# EAGLE schematic headstage-64_via-reduce (EAGLE 8.3.2)
DESIGNER: JON NEWMAN, JAKOB VOIGTS; DESIGN_NAME: HEADSTAGE-64; LICENSE: CERN OHL v1.2; REVISION: 1.2
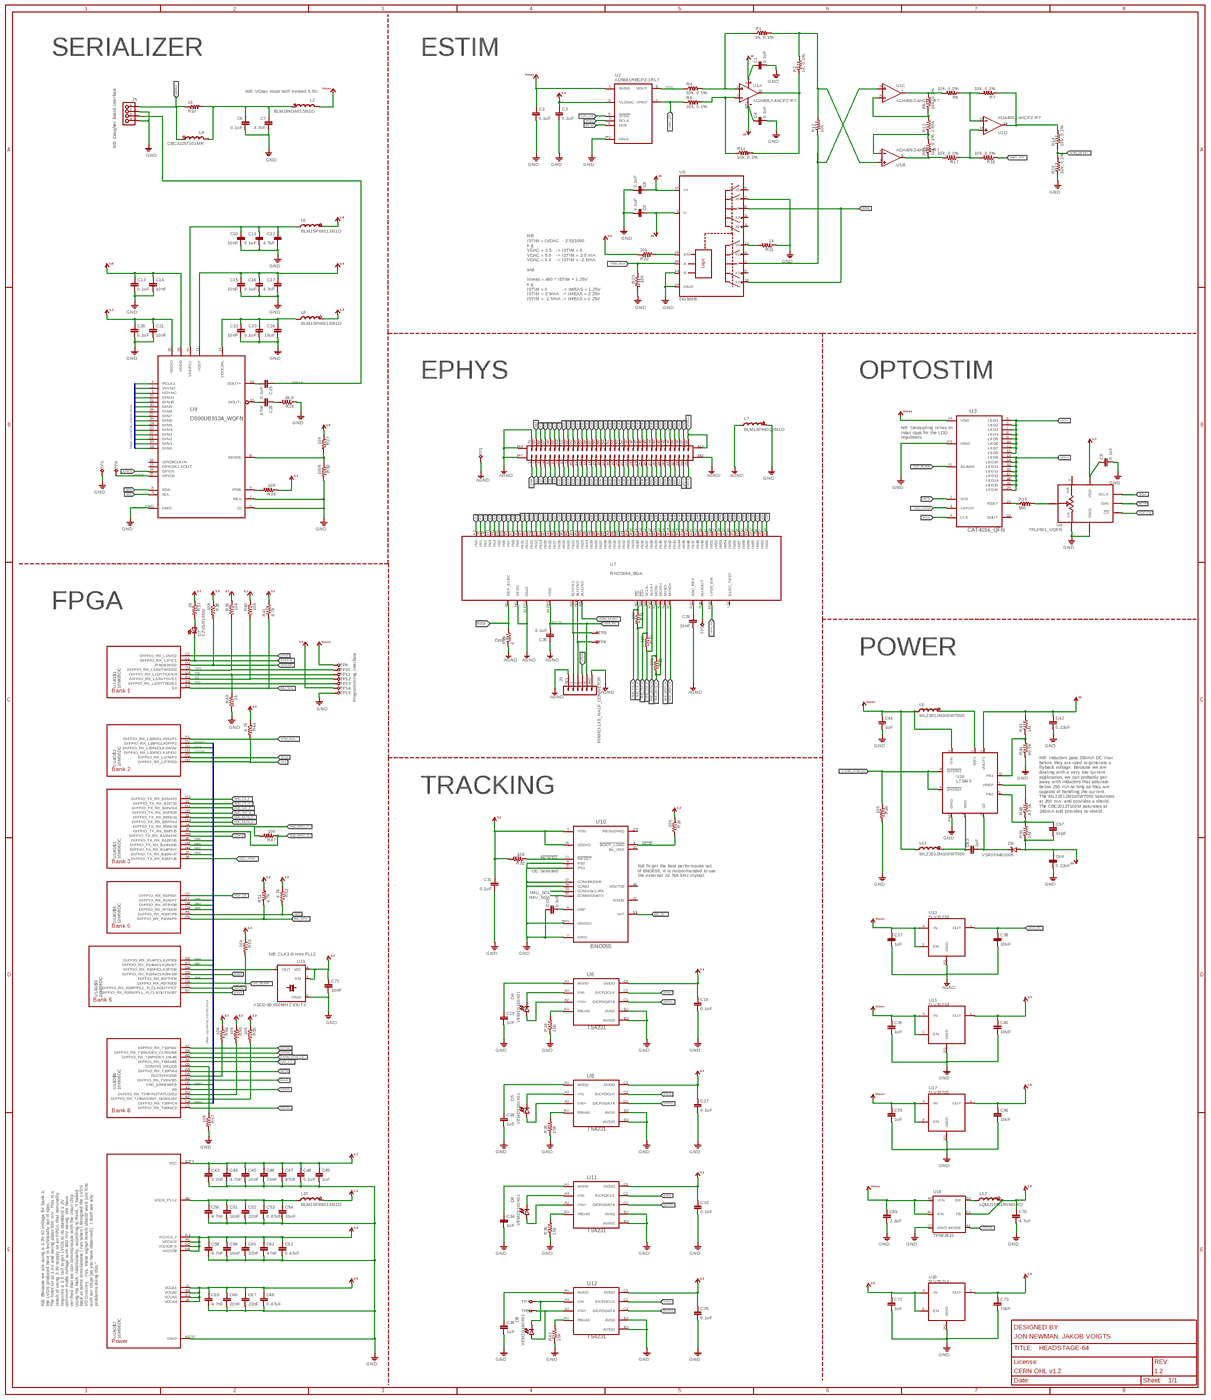
[diagram p0: schematic, sheet 1, overview]
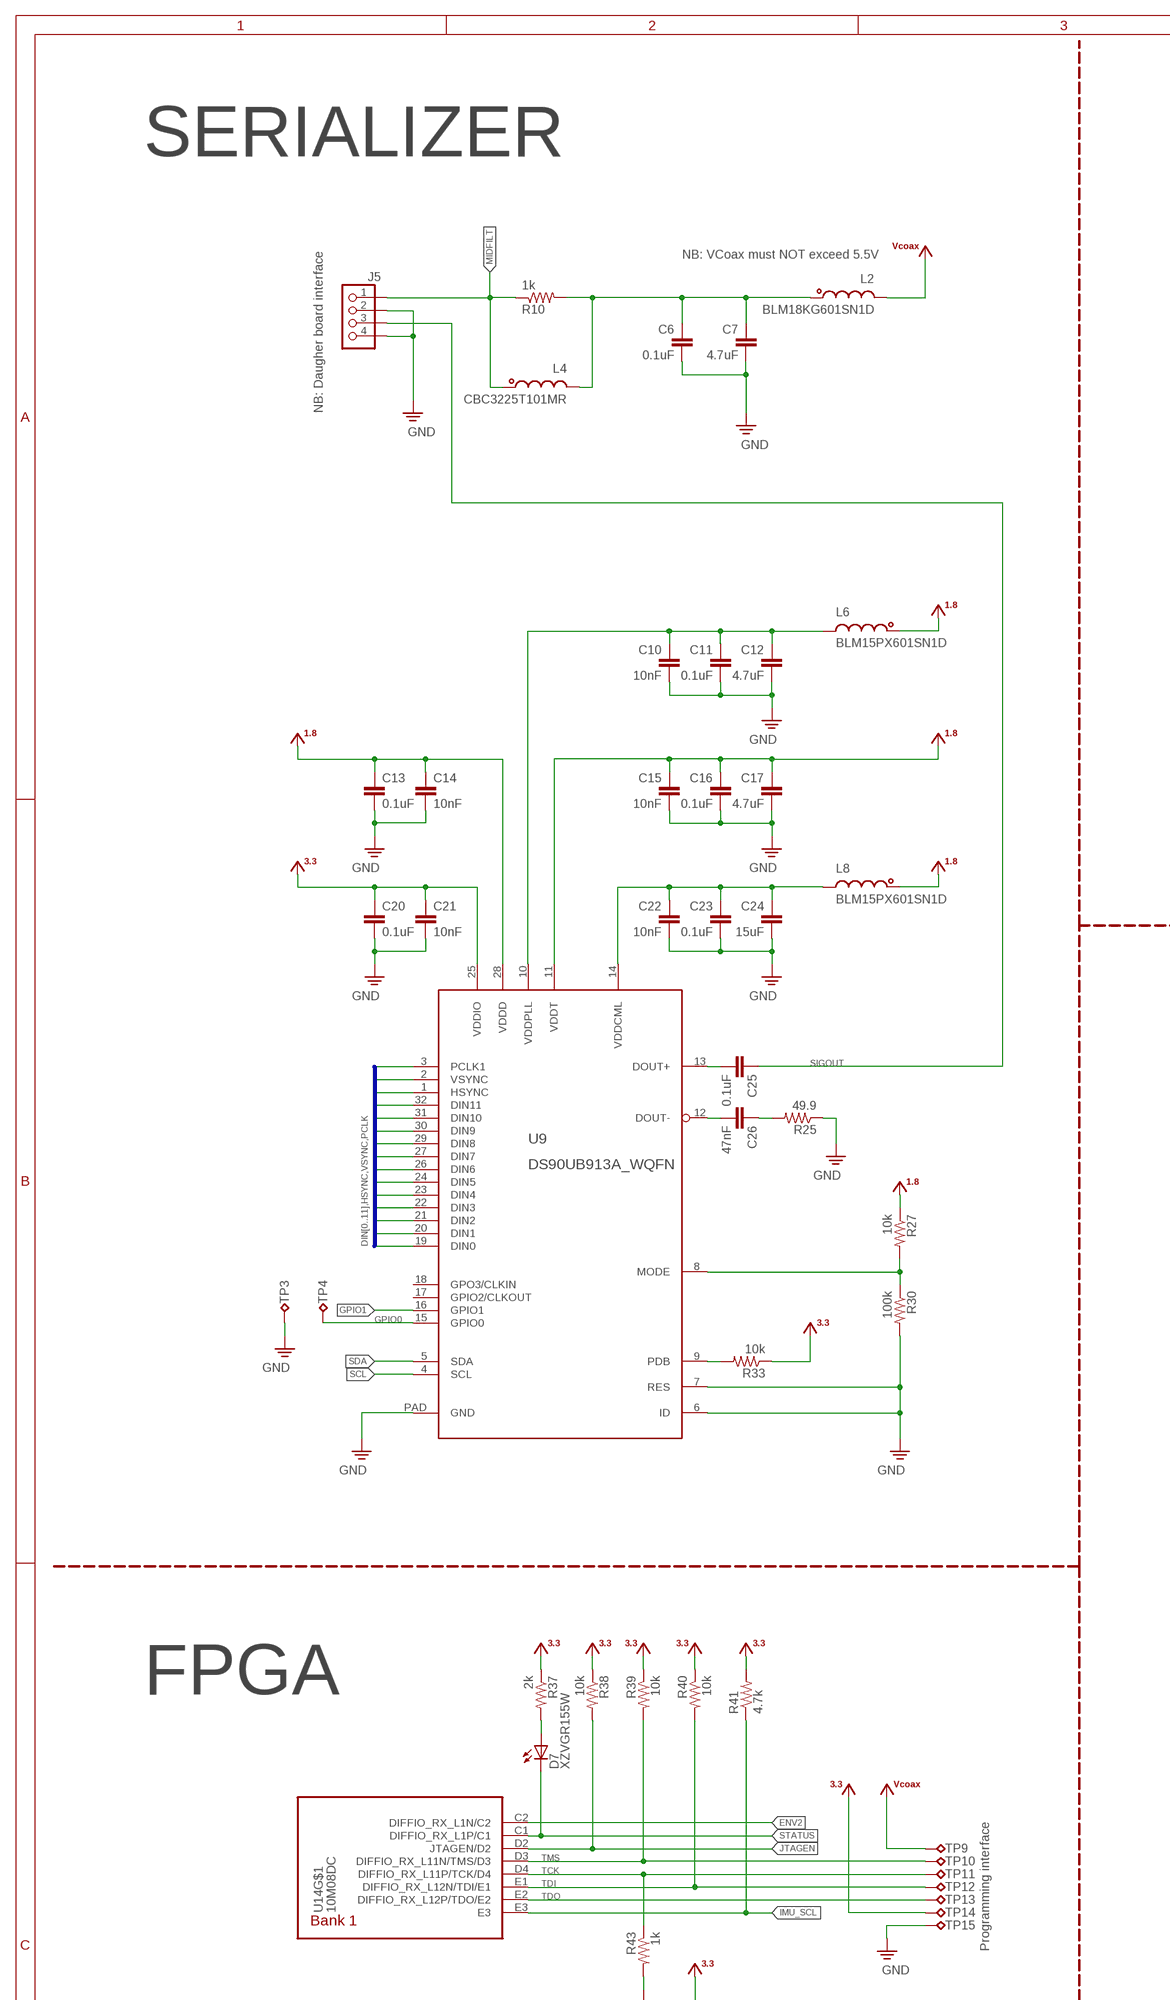
[diagram p1: schematic, sheet 1, part 1 of 4]
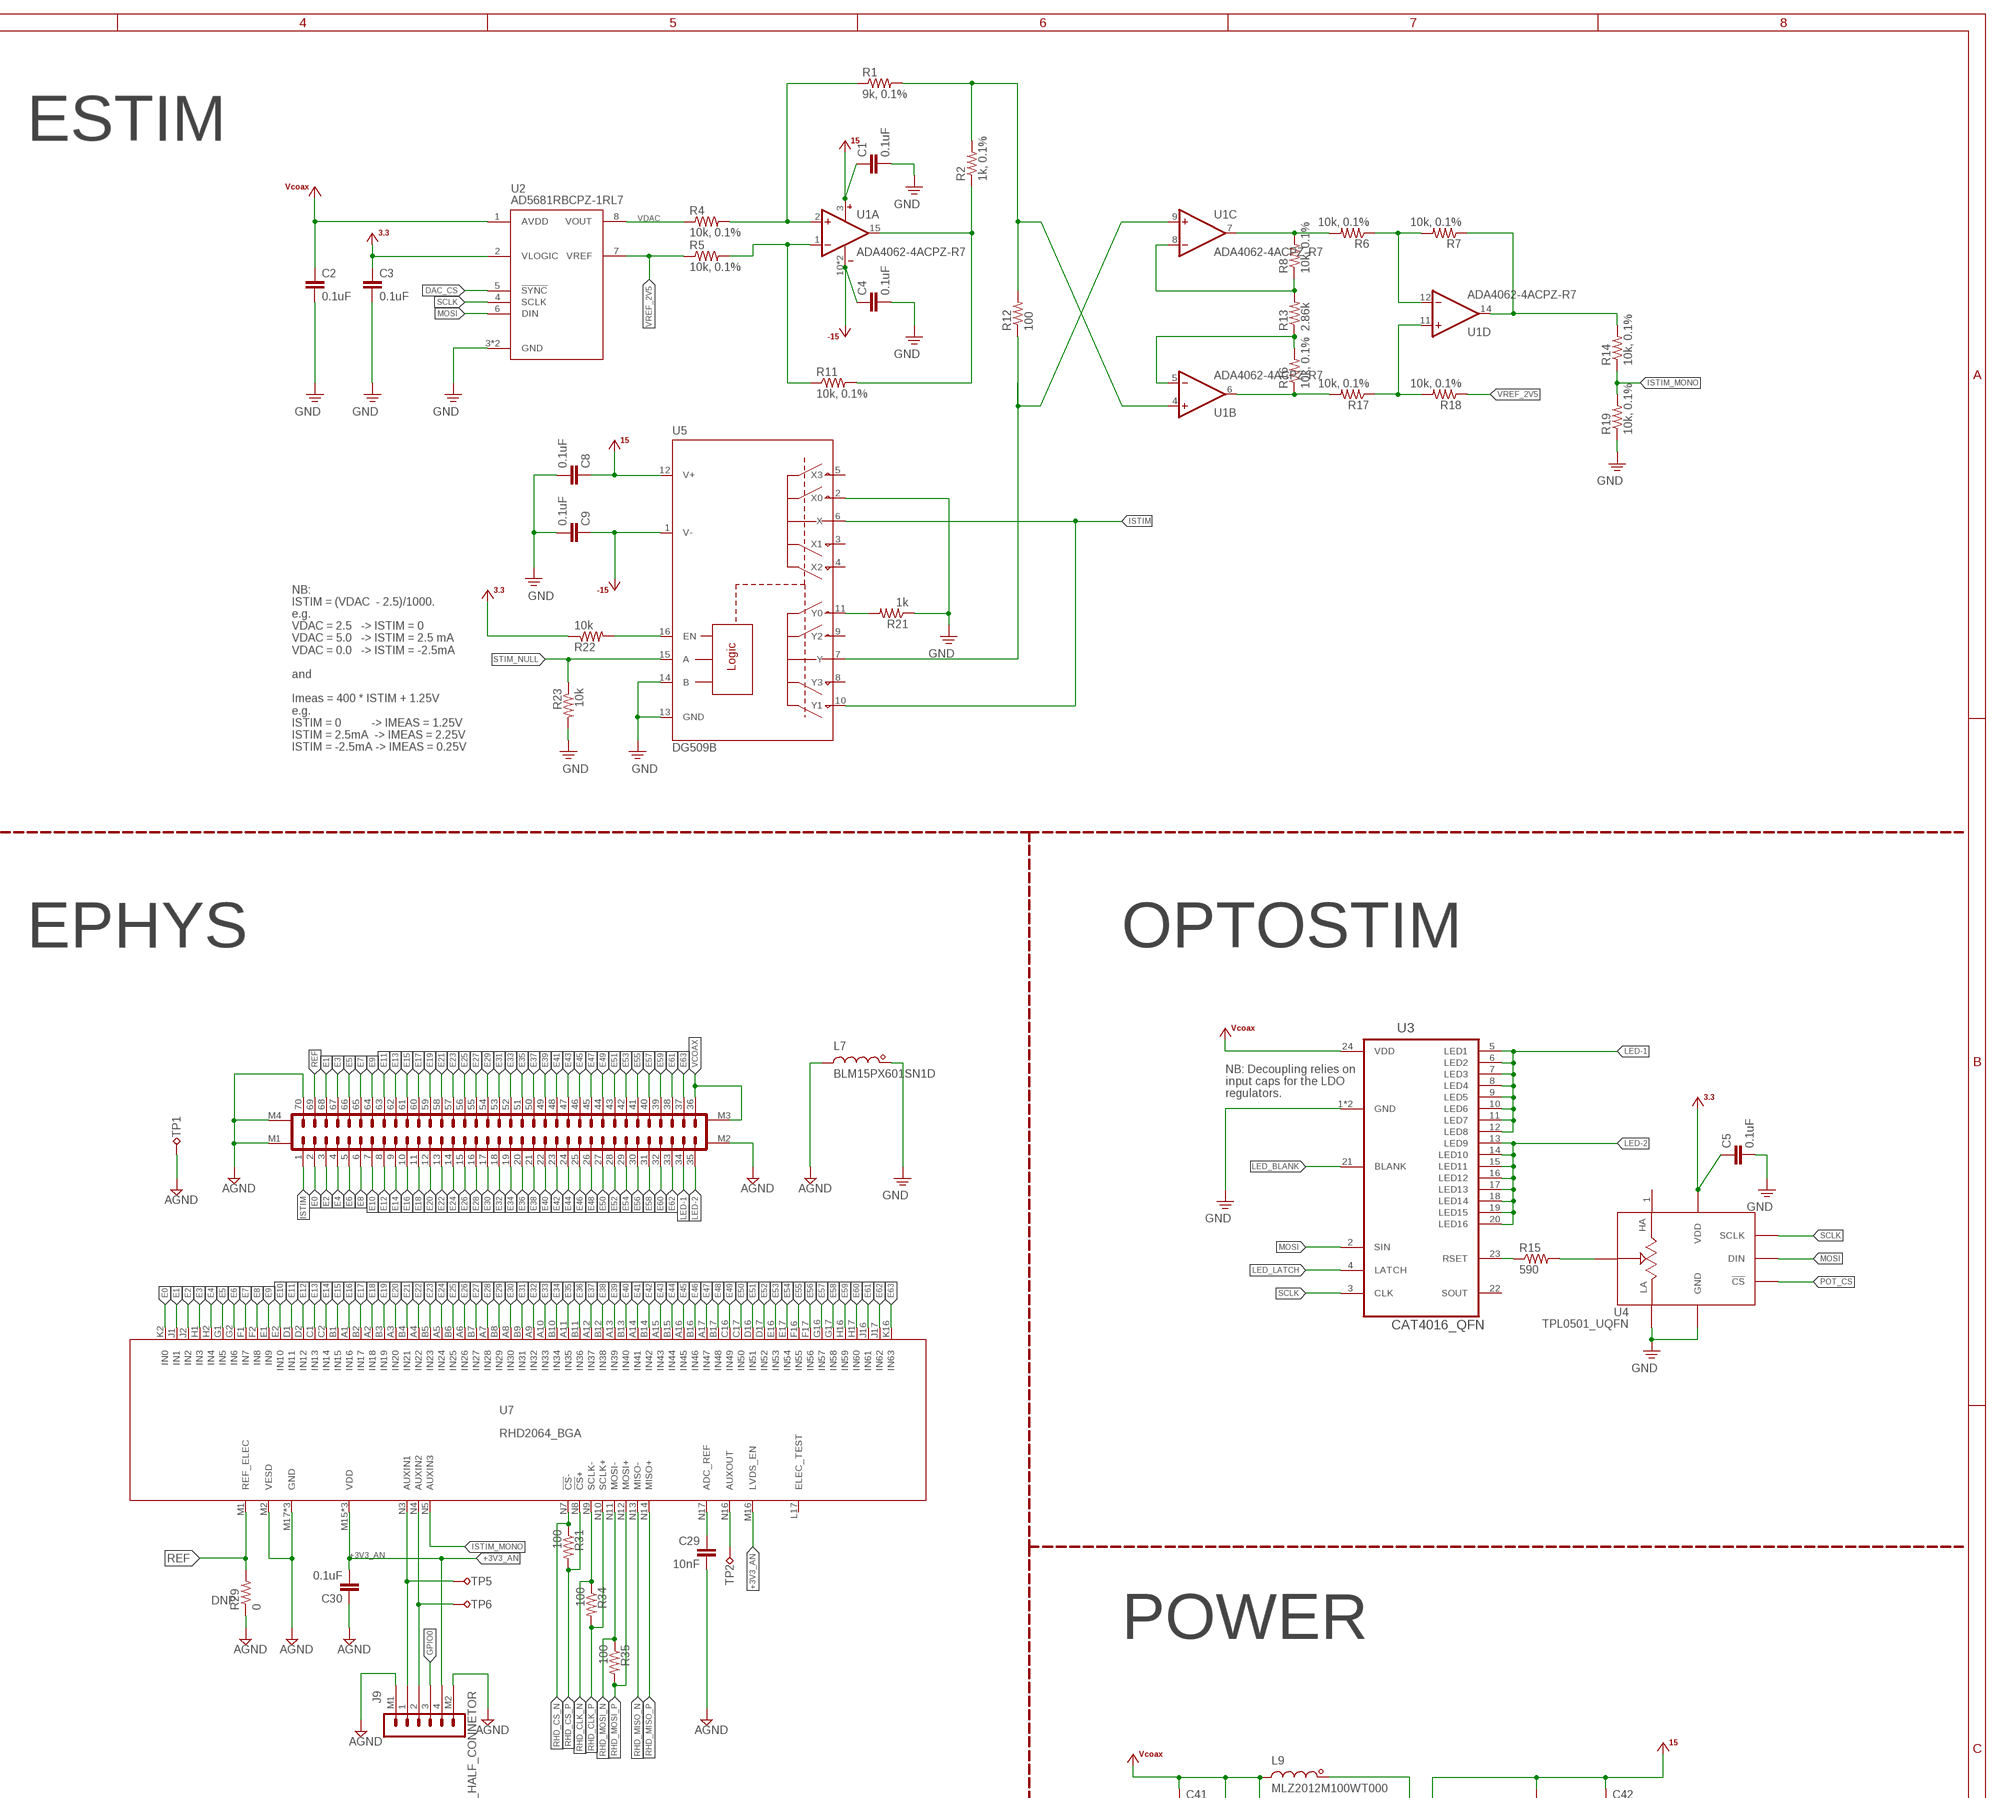
[diagram p2: schematic, sheet 1, part 2 of 4]
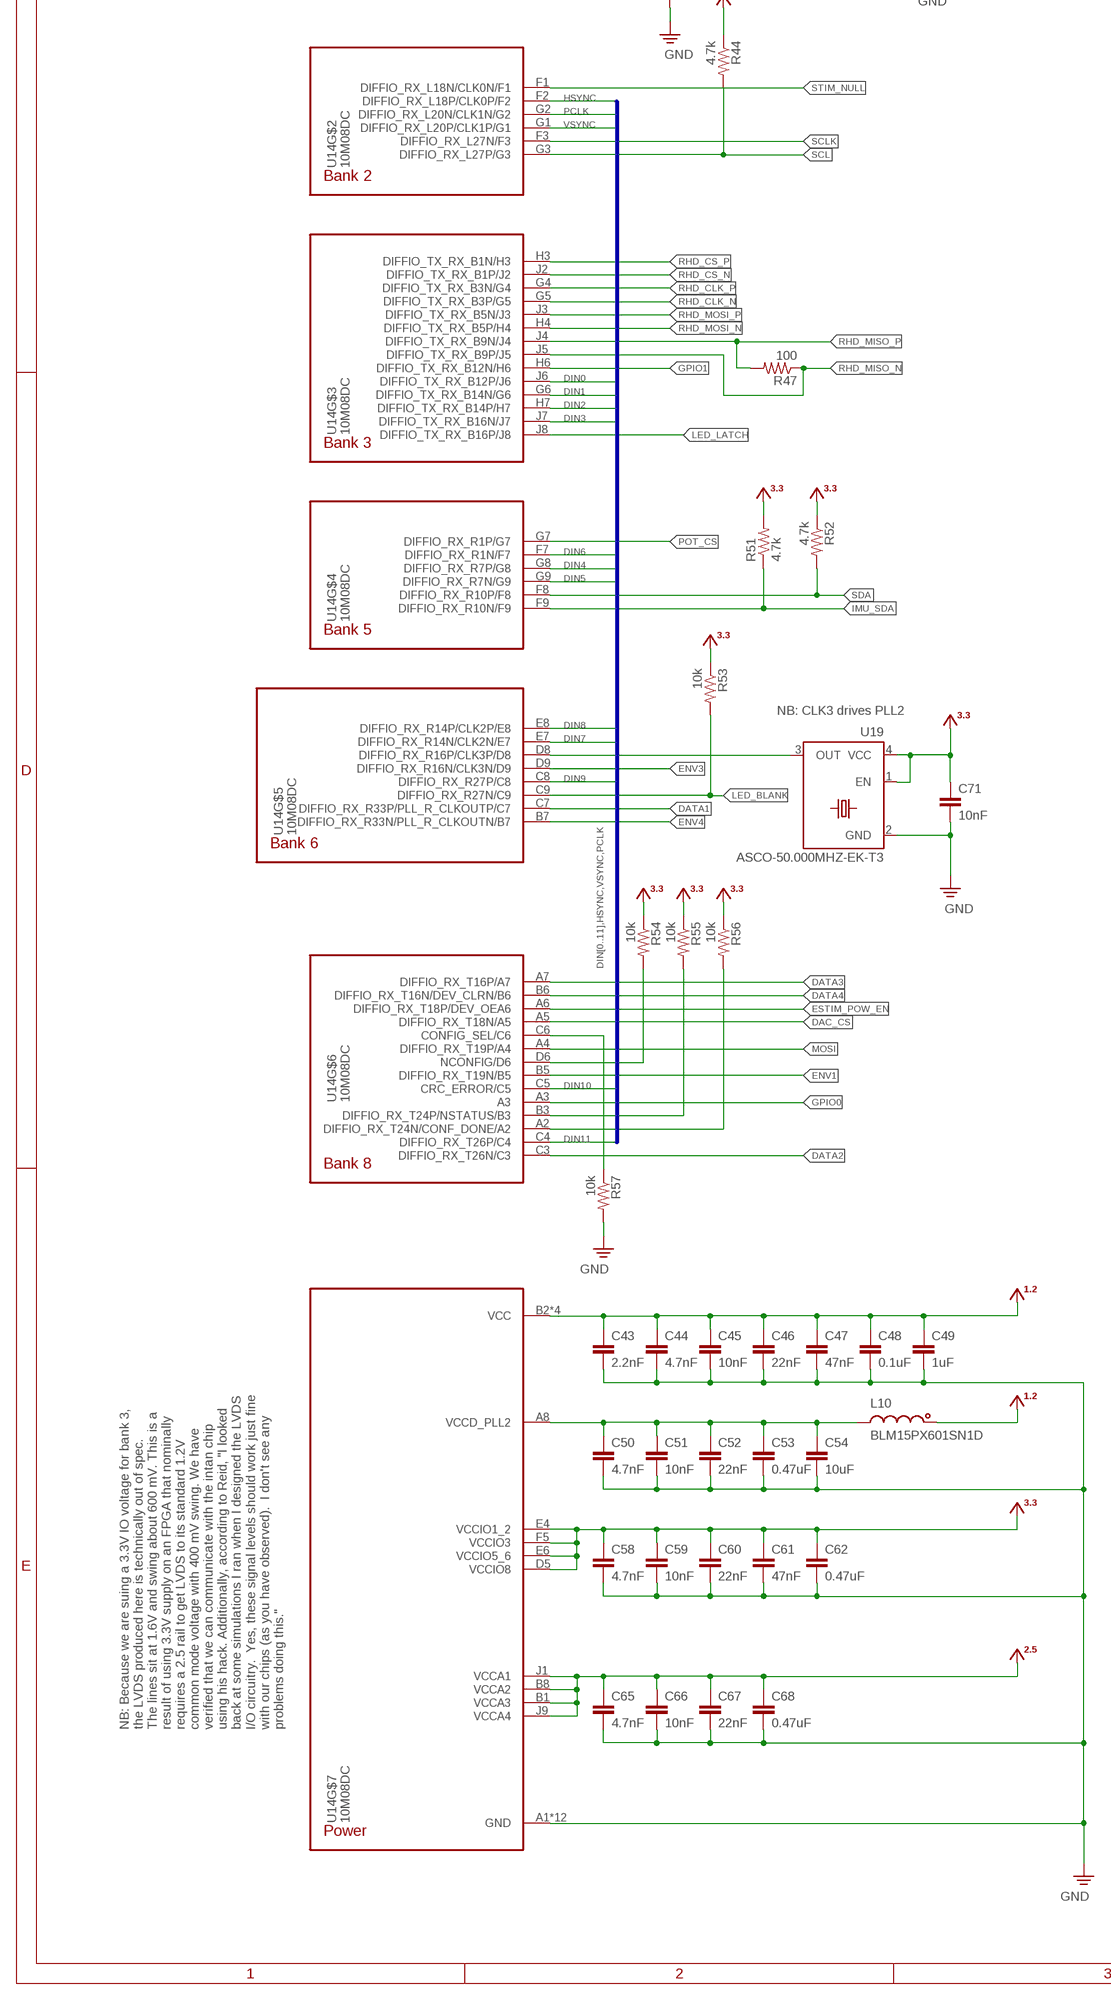
[diagram p3: schematic, sheet 1, part 3 of 4]
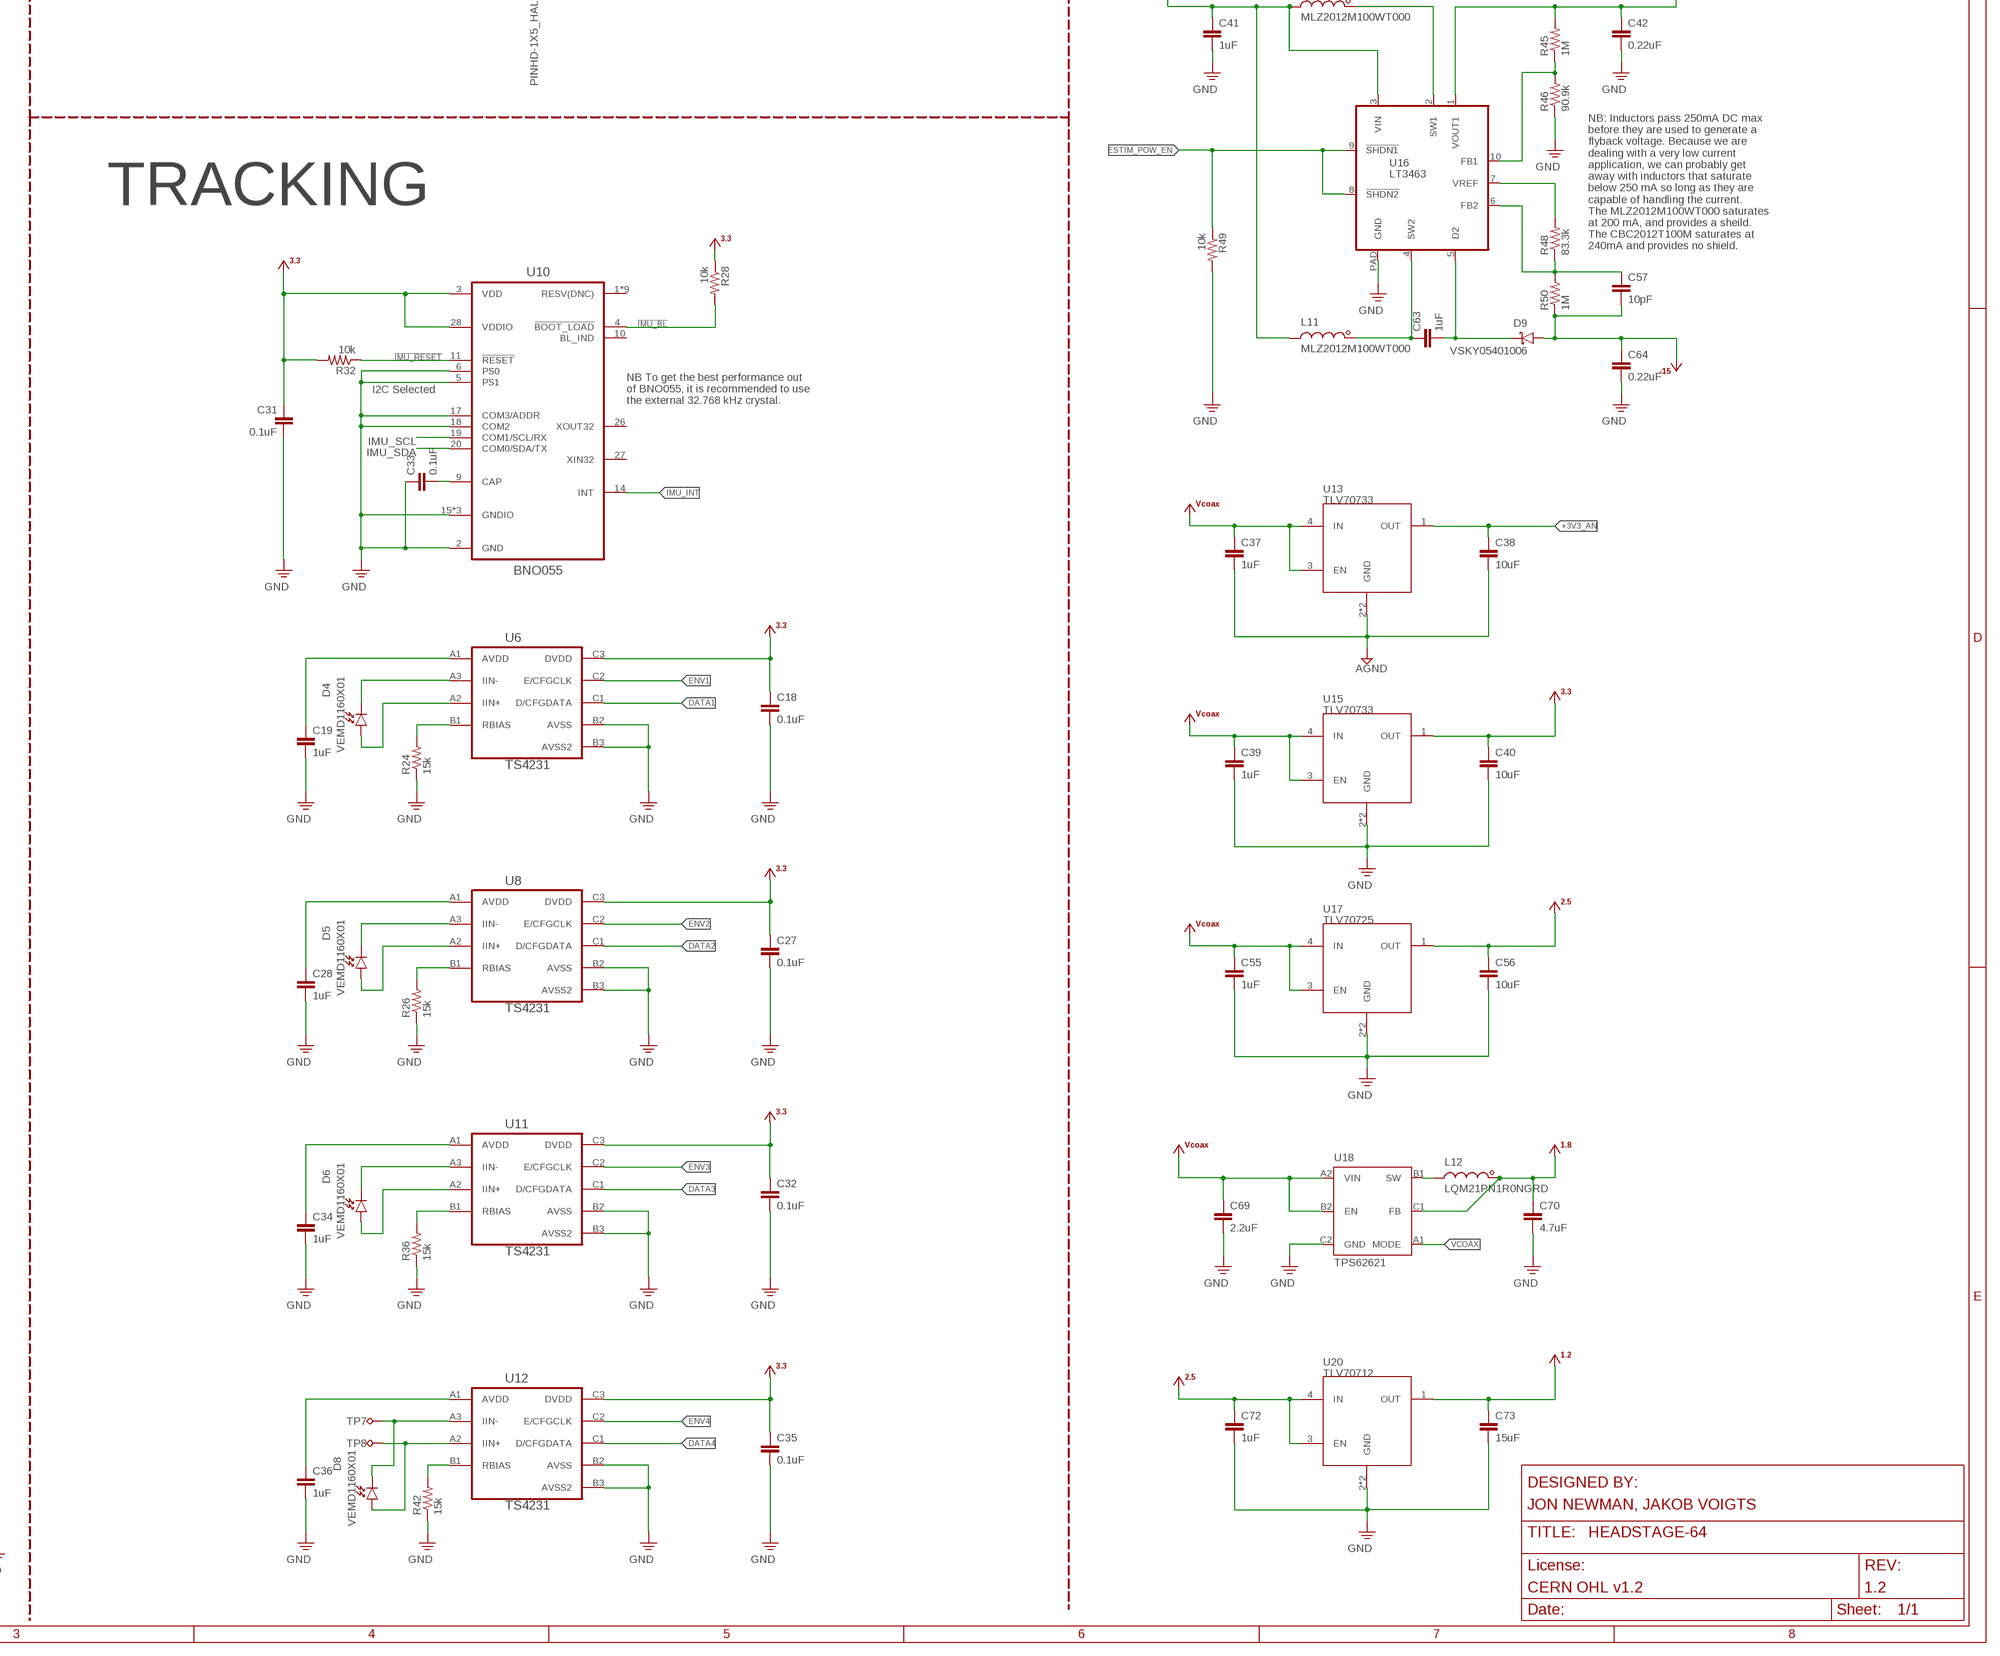
[diagram p4: schematic, sheet 1, part 4 of 4]

## Parts
C1  0.1uF  C_0201T  [0201T]
C2  0.1uF  C_0201T  [0201T]
C3  0.1uF  C_0201T  [0201T]
C4  0.1uF  C_0201T  [0201T]
C5  0.1uF  C_0201T  [0201T]
C6  0.1uF  C_0201T  [0201T]
C7  4.7uF  C_0402T  [0402T]
C8  0.1uF  C_0201T  [0201T]
C9  0.1uF  C_0201T  [0201T]
C10  10nF  C_0201T  [0201T]
C11  0.1uF  C_0201T  [0201T]
C12  4.7uF  C_0402T  [0402T]
C13  0.1uF  C_0201T  [0201T]
C14  10nF  C_0201T  [0201T]
C15  10nF  C_0201T  [0201T]
C16  0.1uF  C_0201T  [0201T]
C17  4.7uF  C_0402T  [0402T]
C18  0.1uF  C_0201T  [0201T]
C19  1uF  C_0201T  [0201T]
C20  0.1uF  C_0201T  [0201T]
C21  10nF  C_0201T  [0201T]
C22  10nF  C_0201T  [0201T]
C23  0.1uF  C_0201T  [0201T]
C24  15uF  C_0402T  [0402T]
C25  0.1uF  C_0201T  [0201T]
C26  47nF  C_0201T  [0201T]
C27  0.1uF  C_0201T  [0201T]
C28  1uF  C_0201T  [0201T]
C29  10nF  C_0201T  [0201T]
C30  0.1uF  C_0201T  [0201T]
C31  0.1uF  C_0201T  [0201T]
C32  0.1uF  C_0201T  [0201T]
C33  0.1uF  C_0201T  [0201T]
C34  1uF  C_0201T  [0201T]
C35  0.1uF  C_0201T  [0201T]
C36  1uF  C_0201T  [0201T]
C37  1uF  C_0402T  [0402T]
C38  10uF  C_0402T  [0402T]
C39  1uF  C_0402T  [0402T]
C40  10uF  C_0402T  [0402T]
C41  1uF  C_0402T  [0402T]
C42  0.22uF  C_0402T  [0402T]
C43  2.2nF  C_0201T  [0201T]
C44  4.7nF  C_0201T  [0201T]
C45  10nF  C_0201T  [0201T]
C46  22nF  C_0201T  [0201T]
C47  47nF  C_0201T  [0201T]
C48  0.1uF  C_0201T  [0201T]
C49  1uF  C_0201T  [0201T]
C50  4.7nF  C_0201T  [0201T]
C51  10nF  C_0201T  [0201T]
C52  22nF  C_0201T  [0201T]
C53  0.47uF  C_0201T  [0201T]
C54  10uF  C_0402T  [0402T]
C55  1uF  C_0402T  [0402T]
C56  10uF  C_0402T  [0402T]
C57  10pF  C_0201T  [0201T]
C58  4.7nF  C_0201T  [0201T]
C59  10nF  C_0201T  [0201T]
C60  22nF  C_0201T  [0201T]
C61  47nF  C_0201T  [0201T]
C62  0.47uF  C_0201T  [0201T]
C63  1uF  C_0402T  [0402T]
C64  0.22uF  C_0402T  [0402T]
C65  4.7nF  C_0201T  [0201T]
C66  10nF  C_0201T  [0201T]
C67  22nF  C_0201T  [0201T]
C68  0.47uF  C_0201T  [0201T]
C69  2.2uF  C_0402T  [0402T]
C70  4.7uF  C_0402T  [0402T]
C71  10nF  C_0201T  [0201T]
C72  1uF  C_0402T  [0402T]
C73  15uF  C_0402T  [0402T]
D4  VEMD1160X01  PHOTODIODE_0805PT  [0805PT]
D5  VEMD1160X01  PHOTODIODE_0805PT  [0805PT]
D6  VEMD1160X01  PHOTODIODE_0805PT  [0805PT]
D7  XZVGR155W  LED_0201T  [LED-0201T]
D8  VEMD1160X01  PHOTODIODE_0805PT  [0805PT]
D9  VSKY05401006  S-DIODE_CLP1006-2L  [CLP1006-2L]
J5  PINHD-1X4HEADSTAGE64_DAUGHTER-CARD  [HEADSTAGE-64-DAUGHTER-CARD]
J8  DF40C-70DP-0.4V(51)  PINHD-2X35+4DF40-70HEAD-LESS-SILK  [DF40-70HEAD-LESS-SILK]
J9  PINHD-1X5_HALF_CONNETOR  [DF40-10HEAD_HALF]
L2  BLM18KG601SN1D  L_0603T  [0603T]
L4  CBC3225T101MR  L_1210T  [1210T]
L6  BLM15PX601SN1D  L_0402T  [0402T]
L7  BLM15PX601SN1D  L_0402T  [0402T]
L8  BLM15PX601SN1D  L_0402T  [0402T]
L9  MLZ2012M100WT000  L_0805T  [0805T]
L10  BLM15PX601SN1D  L_0402T  [0402T]
L11  MLZ2012M100WT000  L_0805T  [0805T]
L12  LQM21PN1R0NGRD  L_0805T  [0805T]
R1  9k, 0.1%  R_0201T  [0201T]
R2  1k, 0.1%  R_0201T  [0201T]
R4  10k, 0.1%  R_0201T  [0201T]
R5  10k, 0.1%  R_0201T  [0201T]
R6  10k, 0.1%  R_0201T  [0201T]
R7  10k, 0.1%  R_0201T  [0201T]
R8  10k, 0.1%  R_0201T  [0201T]
R10  1k  R_0201T  [0201T]
R11  10k, 0.1%  R_0201T  [0201T]
R12  100  R_0201T  [0201T]
R13  2.86k  R_0201T  [0201T]
R14  10k, 0.1%  R_0201T  [0201T]
R15  590  R_0201T  [0201T]
R16  10k, 0.1%  R_0201T  [0201T]
R17  10k, 0.1%  R_0201T  [0201T]
R18  10k, 0.1%  R_0201T  [0201T]
R19  10k, 0.1%  R_0201T  [0201T]
R21  1k  R_0201T  [0201T]
R22  10k  R_0201T  [0201T]
R23  10k  R_0201T  [0201T]
R24  15k  R_0201T  [0201T]
R25  49.9  R_0201T  [0201T]
R26  15k  R_0201T  [0201T]
R27  10k  R_0201T  [0201T]
R28  10k  R_0201T  [0201T]
R29  0  R_0201T  [0201T]
R30  100k  R_0201T  [0201T]
R31  100  R_0201T  [0201T]
R32  10k  R_0201T  [0201T]
R33  10k  R_0201T  [0201T]
R34  100  R_0201T  [0201T]
R35  100  R_0201T  [0201T]
R36  15k  R_0201T  [0201T]
R37  2k  R_0201T  [0201T]
R38  10k  R_0201T  [0201T]
R39  10k  R_0201T  [0201T]
R40  10k  R_0201T  [0201T]
R41  4.7k  R_0201T  [0201T]
R42  15k  R_0201T  [0201T]
R43  1k  R_0201T  [0201T]
R44  4.7k  R_0201T  [0201T]
R45  1M  R_0201T  [0201T]
R46  90.9k  R_0201T  [0201T]
R47  100  R_0201T  [0201T]
R48  83.3k  R_0201T  [0201T]
R49  10k  R_0201T  [0201T]
R50  1M  R_0201T  [0201T]
R51  4.7k  R_0201T  [0201T]
R52  4.7k  R_0201T  [0201T]
R53  10k  R_0201T  [0201T]
R54  10k  R_0201T  [0201T]
R55  10k  R_0201T  [0201T]
R56  10k  R_0201T  [0201T]
R57  10k  R_0201T  [0201T]
TP1  VCC  TPTP07R  [TP07R]
TP2  VCC  TPTP07R  [TP07R]
TP3  TPTP09R  [TP09R]
TP4  TPTP09R  [TP09R]
TP5  VCC  TPTP07R  [TP07R]
TP6  VCC  TPTP07R  [TP07R]
TP7  TPTP06R  [TP06R]
TP8  TPTP06R  [TP06R]
TP9  TPTP06R  [TP06R]
TP10  TPTP06R  [TP06R]
TP11  TPTP06R  [TP06R]
TP12  TPTP06R  [TP06R]
TP13  TPTP06R  [TP06R]
TP14  gnd  TPTP06R  [TP06R]
TP15  VCC  TPTP06R  [TP06R]
U1  ADA4062-4ACPZ-R7  QUAD-OPAMP_14PIN_CP_16_27_L  [CP_16_27-L]
U2  AD5681RBCPZ-1RL7  AD5683-VLOGIC_CP_8_10-L  [CP_8_10-L]
U3  CAT4016_QFN  [QFN24-4X4]
U4  TPL0501_UQFN  [UQFN]
U5  DG509B  MUX_2X4:1_DG509B-MQFN  [MQFN16-1.8X2.6]
U6  TS4231  [WLCSP3X3]
U7  RHD2064_BGA  RHD2164_BGA_BGA  [BGA104_0.5MM]
U8  TS4231  [WLCSP3X3]
U9  DS90UB913A_WQFN  [WQFN32-5X5]
U10  BNO055  [LGA-28-3.8X5.2]
U11  TS4231  [WLCSP3X3]
U12  TS4231  [WLCSP3X3]
U13  TLV70733  TLV707  [X2SON]
U14  10M08DC  10M08DC_VBGA  [VBGA81-4X4]
U15  TLV70733  TLV707  [X2SON]
U16  LT3463  [DFN103X3]
U17  TLV70725  TLV707  [X2SON]
U18  TPS62621  TPS6262X  [XBGA6_1.2X0.8]
U19  ASCO-50.000MHZ-EK-T3  CRYSTAL-OSC_ASCO  [ASCO]
U20  TLV70712  TLV707  [X2SON]

## Nets
!IMU_BL: R28.2 U10.4(!BOOT_LOAD)
!IMU_RESET: R32.1 U10.11(!RESET)
$N324: C50.1 C51.1 C52.1 C53.1 C54.1 L10.2 U14.A8(VCCD_PLL2)
+1V2: C43.1 C44.1 C45.1 C46.1 C47.1 C48.1 C49.1 C73.1 L10.1 U14.B2(VCC) U14.B9(VCC) U14.H2(VCC) U14.H8(VCC) U20.1(OUT)
+1V8: C13.1 C14.1 C15.1 C16.1 C17.1 C70.1 L6.1 L8.1 L12.1 R27.1 U9.11(VDDT) U9.28(VDDD) U18.C1(FB)
+2V5: C56.1 C65.1 C66.1 C67.1 C68.1 C72.1 U14.B1(VCCA3) U14.B8(VCCA2) U14.J1(VCCA1) U14.J9(VCCA4) U17.1(OUT) U20.3(EN) U20.4(IN)
+3V3: C3.1 C5.1 C18.1 C20.1 C21.1 C27.1 C31.1 C32.1 C35.1 C40.1 C58.1 C59.1 C60.1 C61.1 C62.1 C71.1 R22.1 R28.1 R32.2 R33.1 R37.1 R38.1 R39.1 R40.1 R41.2 R44.1 R51.2 R52.1 R53.1 R54.1 R55.1 R56.1 TP14.TP U2.2(VLOGIC) U4.7(VDD) U6.C3(DVDD) U8.C3(DVDD) U9.25(VDDIO) U10.3(VDD) U10.28(VDDIO) U11.C3(DVDD) U12.C3(DVDD) U14.D5(VCCIO8) U14.E4(VCCIO1_2) U14.E6(VCCIO5_6) U14.F5(VCCIO3) U15.1(OUT) U19.1(EN) U19.4(VCC)
+3V3_AN: C30.2 C38.1 J9.4 U7.M15(VDD) U7.M16(LVDS_EN) U7.N2(VDD) U7.N15(VDD) U13.1(OUT)
+15V0: C1.1 C8.1 C42.1 R45.2 U1.3(P:V+) U5.12(V+) U16.1(VOUT1) ; supply symbol labelled +15V
-15V0: C4.1 C9.1 C57.2 C64.1 D9.A R50.1 U1.10(P:V-) U1.PAD(P:V-) U5.1(V-) ; supply symbol labelled -15V
AGND: C29.2 C30.1 C37.2 C38.2 J8.70 J8.M1 J8.M2 J8.M4 J9.M1 J9.M2 L7.2 R29.1 TP1.TP U7.M2(VESD) U7.M17(GND) U7.N1(GND) U7.N6(GND) U13.2(GND) U13.PAD(GND)
AUXIN2: J9.2 TP6.TP U7.N4(AUXIN2)
AUXIN3: J9.1 TP5.TP U7.N3(AUXIN1)
CONF_DONE: R56.2 U14.A2(DIFFIO_RX_T24N/CONF_DONE/A2)
CONFIG_SEL: R57.1 U14.C6(CONFIG_SEL/C6)
DAC_CS: U2.5(!SYNC) U14.A5(DIFFIO_RX_T18N/A5)
DATA1: U6.C1(D/CFGDATA) U14.C7(DIFFIO_RX_R33P/PLL_R_CLKOUTP/C7)
DATA2: U8.C1(D/CFGDATA) U14.C3(DIFFIO_RX_T26N/C3)
DATA3: U11.C1(D/CFGDATA) U14.A7(DIFFIO_RX_T16P/A7)
DATA4: U12.C1(D/CFGDATA) U14.B6(DIFFIO_RX_T16N/DEV_CLRN/B6)
DIN0: U9.19(DIN0) U14.J6(DIFFIO_TX_RX_B12P/J6)
DIN1: U9.20(DIN1) U14.G6(DIFFIO_TX_RX_B14N/G6)
DIN2: U9.21(DIN2) U14.H7(DIFFIO_TX_RX_B14P/H7)
DIN3: U9.22(DIN3) U14.J7(DIFFIO_TX_RX_B16N/J7)
DIN4: U9.23(DIN4) U14.G8(DIFFIO_RX_R7P/G8)
DIN5: U9.24(DIN5) U14.G9(DIFFIO_RX_R7N/G9)
DIN6: U9.26(DIN6) U14.F7(DIFFIO_RX_R1N/F7)
DIN7: U9.27(DIN7) U14.E7(DIFFIO_RX_R14N/CLK2N/E7)
DIN8: U9.29(DIN8) U14.E8(DIFFIO_RX_R14P/CLK2P/E8)
DIN9: U9.30(DIN9) U14.C8(DIFFIO_RX_R27P/C8)
DIN10: U9.31(DIN10) U14.C5(CRC_ERROR/C5)
DIN11: U9.32(DIN11) U14.C4(DIFFIO_RX_T26P/C4)
E0: J8.2 U7.K2(IN0)
E1: J8.68 U7.J1(IN1)
E2: J8.3 U7.J2(IN2)
E3: J8.67 U7.H1(IN3)
E4: J8.4 U7.H2(IN4)
E5: J8.66 U7.G1(IN5)
E6: J8.5 U7.G2(IN6)
E7: J8.65 U7.F1(IN7)
E8: J8.6 U7.F2(IN8)
E9: J8.64 U7.E1(IN9)
E10: J8.7 U7.E2(IN10)
E11: J8.63 U7.D1(IN11)
E12: J8.8 U7.D2(IN12)
E13: J8.62 U7.C1(IN13)
E14: J8.9 U7.C2(IN14)
E15: J8.61 U7.B1(IN15)
E16: J8.10 U7.A1(IN16)
E17: J8.60 U7.B2(IN17)
E18: J8.11 U7.A2(IN18)
E19: J8.59 U7.B3(IN19)
E20: J8.12 U7.A3(IN20)
E21: J8.58 U7.B4(IN21)
E22: J8.13 U7.A4(IN22)
E23: J8.57 U7.B5(IN23)
E24: J8.14 U7.A5(IN24)
E25: J8.56 U7.B6(IN25)
E26: J8.15 U7.A6(IN26)
E27: J8.55 U7.B7(IN27)
E28: J8.16 U7.A7(IN28)
E29: J8.54 U7.B8(IN29)
E30: J8.17 U7.A8(IN30)
E31: J8.53 U7.B9(IN31)
E32: J8.18 U7.A9(IN32)
E33: J8.52 U7.A10(IN33)
E34: J8.19 U7.B10(IN34)
E35: J8.51 U7.A11(IN35)
E36: J8.20 U7.B11(IN36)
E37: J8.50 U7.A12(IN37)
E38: J8.21 U7.B12(IN38)
E39: J8.49 U7.A13(IN39)
E40: J8.22 U7.B13(IN40)
E41: J8.48 U7.A14(IN41)
E42: J8.23 U7.B14(IN42)
E43: J8.47 U7.A15(IN43)
E44: J8.24 U7.B15(IN44)
E45: J8.46 U7.A16(IN45)
E46: J8.25 U7.B16(IN46)
E47: J8.45 U7.A17(IN47)
E48: J8.26 U7.B17(IN48)
E49: J8.44 U7.C16(IN49)
E50: J8.27 U7.C17(IN50)
E51: J8.43 U7.D16(IN51)
E52: J8.28 U7.D17(IN52)
E53: J8.42 U7.E16(IN53)
E54: J8.29 U7.E17(IN54)
E55: J8.41 U7.F16(IN55)
E56: J8.30 U7.F17(IN56)
E57: J8.40 U7.G16(IN57)
E58: J8.31 U7.G17(IN58)
E59: J8.39 U7.H16(IN59)
E60: J8.32 U7.H17(IN60)
E61: J8.38 U7.J16(IN61)
E62: J8.33 U7.J17(IN62)
E63: J8.37 U7.K16(IN63)
ENV1: U6.C2(E/CFGCLK) U14.B5(DIFFIO_RX_T19N/B5)
ENV2: U8.C2(E/CFGCLK) U14.C2(DIFFIO_RX_L1N/C2)
ENV3: U11.C2(E/CFGCLK) U14.D9(DIFFIO_RX_R16N/CLK3N/D9)
ENV4: U12.C2(E/CFGCLK) U14.B7(DIFFIO_RX_R33N/PLL_R_CLKOUTN/B7)
ESTIM_POW_EN: R49.1 U14.A6(DIFFIO_RX_T18P/DEV_OEA6) U16.8(!SHDN2) U16.9(!SHDN1)
GND: C1.2 C2.2 C3.2 C4.2 C5.2 C6.2 C7.2 C8.2 C9.2 C10.2 C11.2 C12.2 C13.2 C14.2 C15.2 C16.2 C17.2 C18.2 C19.2 C20.2 C21.2 C22.2 C23.2 C24.2 C27.2 C28.2 C31.2 C32.2 C33.1 C34.2 C35.2 C36.2 C39.2 C40.2 C41.2 C42.2 C43.2 C44.2 C45.2 C46.2 C47.2 C48.2 C49.2 C50.2 C51.2 C52.2 C53.2 C54.2 C55.2 C56.2 C58.2 C59.2 C60.2 C61.2 C62.2 C64.2 C65.2 C66.2 C67.2 C68.2 C69.2 C70.2 C71.2 C72.2 C73.2 J5.2 J5.4 L7.1 R19.1 R21.1 R23.2 R24.1 R25.1 R26.1 R30.2 R36.1 R42.1 R43.2 R46.1 R49.2 R57.2 TP3.TP TP15.TP U2.3(GND) U2.PAD(GND) U3.1(GND) U3.PAD(GND) U4.4(GND) U4.8(LA) U5.2(X0) U5.13(GND) U5.14(B) U6.B2(AVSS) U6.B3(AVSS2) U8.B2(AVSS) U8.B3(AVSS2) U9.6(ID) U9.7(RES) U9.PAD(GND) U10.2(GND) U10.5(PS1) U10.6(PS0) U10.15(GNDIO) U10.16(GNDIO) U10.17(COM3/ADDR) U10.18(COM2) U10.25(GNDIO) U11.B2(AVSS) U11.B3(AVSS2) U12.B2(AVSS) U12.B3(AVSS2) U14.A1(GND) U14.A9(GND) U14.B4(GND) U14.D1(GND) U14.D7(GND) U14.E5(GND) U14.E9(GND) U14.F4(GND) U14.F6(GND) U14.H1(GND) U14.H5(GND) U14.H9(GND) U15.2(GND) U15.PAD(GND) U16.PAD(GND) U17.2(GND) U17.PAD(GND) U18.C2(GND) U19.2(GND) U20.2(GND) U20.PAD(GND)
GPIO0: J9.3 TP4.TP U9.15(GPIO0) U14.A3
GPIO1: U9.16(GPIO1) U14.H6(DIFFIO_TX_RX_B12N/H6)
HSYNC: U9.1(HSYNC) U14.F2(DIFFIO_RX_L18P/CLK0P/F2)
IMU_INT: U10.14(INT)
IMU_SCL: R41.1 U10.19(COM1/SCL/RX) U14.E3
IMU_SDA: R51.1 U10.20(COM0/SDA/TX) U14.F9(DIFFIO_RX_R10N/F9)
ISTIM: J8.1 U5.6(X) U5.10(Y1)
ISTIM_MONO: R14.1 R19.2 U7.N5(AUXIN3)
ISTIM_PRE: R12.1 U1.9(C:+IN) U5.7(Y)
JTAGEN: R38.2 U14.D2(JTAGEN/D2)
LED-1: J8.34 U3.5(LED1) U3.6(LED2) U3.7(LED3) U3.8(LED4) U3.9(LED5) U3.10(LED6) U3.11(LED7) U3.12(LED8)
LED-2: J8.35 U3.13(LED9) U3.14(LED10) U3.15(LED11) U3.16(LED12) U3.17(LED13) U3.18(LED14) U3.19(LED15) U3.20(LED16)
LED_BLANK: R53.2 U3.21(BLANK) U14.C9(DIFFIO_RX_R27N/C9)
LED_LATCH: U3.4(LATCH) U14.J8(DIFFIO_TX_RX_B16P/J8)
MIDFILT: J5.1 L4.1 R10.1
MOSI: U2.6(DIN) U3.2(SIN) U4.2(DIN) U14.A4(DIFFIO_RX_T19P/A4)
N$1: R15.2 U4.6(WA)
N$2: C63.1 L11.1 U16.4(SW2)
N$3: C57.1 R48.1 R50.2 U16.6(FB2)
N$4: D4.C U6.A3(IIN-)
N$5: D4.A U6.A2(IIN+)
N$6: R24.2 U6.B1(RBIAS)
N$7: C19.1 U6.A1(AVDD)
N$8: L9.1 U16.2(SW1)
N$9: D5.C U8.A3(IIN-)
N$10: D5.A U8.A2(IIN+)
N$11: R26.2 U8.B1(RBIAS)
N$12: C28.1 U8.A1(AVDD)
N$13: C6.1 C7.1 L2.1 L4.2 R10.2
N$14: R15.1 U3.23(RSET)
N$15: D6.C U11.A3(IIN-)
N$16: D6.A U11.A2(IIN+)
N$17: R36.2 U11.B1(RBIAS)
N$18: C34.1 U11.A1(AVDD)
N$19: C63.2 D9.C U16.5(D2)
N$20: R1.2 R2.2 R12.2 U1.4(B:+IN)
N$23: R21.2 U5.11(Y0)
N$24: R45.1 R46.2 U16.10(FB1)
N$26: D8.C TP7.TP U12.A3(IIN-)
N$27: R48.2 U16.7(VREF)
N$28: C25.2 U9.13(DOUT+)
N$29: D7.2(A) R37.2
N$30: R33.2 U9.9(PDB)
N$31: C26.2 U9.12(DOUT-)
N$32: C26.1 R25.2
N$33: R27.2 R30.1 U9.8(MODE)
N$34: C10.1 C11.1 C12.1 L6.2 U9.10(VDDPLL)
N$35: C22.1 C23.1 C24.1 L8.2 U9.14(VDDCML)
N$36: C29.1 U7.N17(ADC_REF)
N$37: U14.D8(DIFFIO_RX_R16P/CLK3P/D8) U19.3(OUT)
N$38: D8.A TP8.TP U12.A2(IIN+)
N$39: TP2.TP U7.N16(AUXOUT)
N$41: R42.2 U12.B1(RBIAS)
N$42: C36.1 U12.A1(AVDD)
N$44: R22.2 U5.16(EN)
N$45: R54.2 U14.D6(NCONFIG/D6)
N$46: L12.2 U18.B1(SW)
N$53: R1.1 R4.2 U1.2(A:+IN)
N$54: R5.2 R11.1 U1.1(A:-IN)
N$55: R2.1 R11.2 U1.15(A:OUT)
N$57: R16.1 R17.2 U1.6(B:OUT)
N$59: R13.1 R16.2 U1.5(B:-IN)
N$60: R8.1 R13.2 U1.8(C:-IN)
N$61: R6.2 R8.2 U1.7(C:OUT)
N$62: R7.1 R14.2 U1.14(D:OUT)
N$63: R6.1 R7.2 U1.12(D:-IN)
N$64: R17.1 R18.2 U1.11(D:+IN)
N$67: C33.2 U10.9(CAP)
NSTATUS: R55.2 U14.B3(DIFFIO_RX_T24P/NSTATUS/B3)
PCLK: U9.3(PCLK1) U14.G2(DIFFIO_RX_L20N/CLK1N/G2)
POT_CS: U4.3(!CS) U14.G7(DIFFIO_RX_R1P/G7)
REF: J8.69 R29.2 U7.M1(REF_ELEC)
RHD_CLK_N [diff]: R34.1 U7.N9(SCLK-) U14.G5(DIFFIO_TX_RX_B3P/G5)
RHD_CLK_P [diff]: R34.2 U7.N10(SCLK+) U14.G4(DIFFIO_TX_RX_B3N/G4)
RHD_CS_N [diff]: R31.1 U7.N7(!CS!-) U14.J2(DIFFIO_TX_RX_B1P/J2)
RHD_CS_P [diff]: R31.2 U7.N8(!CS!+) U14.H3(DIFFIO_TX_RX_B1N/H3)
RHD_MISO_N [diff]: R47.1 U7.N13(MISO-) U14.J5(DIFFIO_TX_RX_B9P/J5)
RHD_MISO_P [diff]: R47.2 U7.N14(MISO+) U14.J4(DIFFIO_TX_RX_B9N/J4)
RHD_MOSI_N [diff]: R35.1 U7.N11(MOSI-) U14.H4(DIFFIO_TX_RX_B5P/H4)
RHD_MOSI_P [diff]: R35.2 U7.N12(MOSI+) U14.J3(DIFFIO_TX_RX_B5N/J3)
SCL: R44.2 U9.4(SCL) U14.G3(DIFFIO_RX_L27P/G3)
SCLK: U2.4(SCLK) U3.3(CLK) U4.5(SCLK) U14.F3(DIFFIO_RX_L27N/F3)
SDA: R52.2 U9.5(SDA) U14.F8(DIFFIO_RX_R10P/F8)
SIGOUT: C25.1 J5.3
STATUS: D7.1(C) U14.C1(DIFFIO_RX_L1P/C1)
STIM_NULL: R23.1 U5.15(A) U14.F1(DIFFIO_RX_L18N/CLK0N/F1)
TCK: R43.1 TP11.TP U14.D4(DIFFIO_RX_L11P/TCK/D4)
TDI: R40.2 TP12.TP U14.E1(DIFFIO_RX_L12N/TDI/E1)
TDO: TP13.TP U14.E2(DIFFIO_RX_L12P/TDO/E2)
TMS: R39.2 TP10.TP U14.D3(DIFFIO_RX_L11N/TMS/D3)
VCOAX: C2.1 C37.1 C39.1 C41.1 C55.1 C69.1 J8.36 J8.M3 L2.2 L9.2 L11.2 TP9.TP U2.1(AVDD) U3.24(VDD) U13.3(EN) U13.4(IN) U15.3(EN) U15.4(IN) U16.3(VIN) U17.3(EN) U17.4(IN) U18.A1(MODE) U18.A2(VIN) U18.B2(EN) ; supply symbol labelled +VCOAX
VDAC: R4.1 U2.8(VOUT)
VREF_2V5: R5.1 R18.1 U2.7(VREF)
VSYNC: U9.2(VSYNC) U14.G1(DIFFIO_RX_L20P/CLK1P/G1)
Unconnected: U3.22(SOUT) U4.1(HA) U5.3(X1) U5.4(X2) U5.5(X3) U5.8(Y3) U5.9(Y2) U7.L17(ELEC_TEST) U9.17(GPIO2/CLKOUT) U9.18(GPO3/CLKIN) U10.1(RESV(DNC)) U10.7(RESV(DNC)) U10.8(RESV(DNC)) U10.10(BL_IND) U10.12(RESV(DNC)) U10.13(RESV(DNC)) U10.21(RESV(DNC)) U10.22(RESV(DNC)) U10.23(RESV(DNC)) U10.24(RESV(DNC)) U10.26(XOUT32) U10.27(XIN32)

## Buses
DIN[0..11],HSYNC,VSYNC,PCLK

## Notes on the sheet
- SERIALIZER | ESTIM
- NB: VCoax must NOT exceed 5.5V
- NB: Daugher board interface
- NB:
  ISTIM = (VDAC  - 2.5)/1000.
  e.g. 
  VDAC = 2.5   -> ISTIM = 0
  VDAC = 5.0   -> ISTIM = 2.5 mA
  VDAC = 0.0   -> ISTIM = -2.5mA
  
  and
  
  Imeas = 400 * ISTIM + 1.25V
  e.g. 
  ISTIM = 0          -> IMEAS = 1.25V
  ISTIM = 2.5mA  -> IMEAS = 2.25V
  ISTIM = -2.5mA -> IMEAS = 0.25V
- EPHYS | OPTOSTIM
- NB: Decoupling relies on 
  input caps for the LDO 
  regulators.
- FPGA
- DNP
- POWER
- Programming interface
- TRACKING
- NB: Inductors pass 250mA DC max
  before they are used to generate a
  flyback voltage. Because we are
  dealing with a very low current
  application, we can probably get 
  away with inductors that saturate
  below 250 mA so long as they are
  capable of handling the current. 
  The MLZ2012M100WT000 saturates 
  at 200 mA, and provides a sheild. 
  The CBC2012T100M saturates at
  240mA and provides no shield.
- I2C Selected
- NB To get the best performance out
  of BNO055, it is recommended to use
  the external 32.768 kHz crystal.
- NB: CLK3 drives PLL2
- NB: Because we are suing a 3.3V IO voltage for bank 3,
  the LVDS produced here is technically out of spec.
  The lines sit at 1.6V and swing about 600 mV. This is a
  result of using 3.3V supply on an FPGA that nominally
  requires a 2.5 rail to get LVDS to its standard 1.2V
  common mode voltage with 400 mV swing. We have
  verified that we can communicate with the intan chip
  using his hack. Additionally, according to Reid, "I looked
  back at some simulations I ran when I designed the LVDS
  I/O circuitry.  Yes, these signal levels should work just fine
  with our chips (as you have observed).  I don't see any
  problems doing this."

## Library data of the parts
C1 = jonnew:C: Capacitor; PARTNP: CL03A104KA3NNNC
C2 C3 C5 C6 C18 C27 C32 C33 C35 = jonnew:C: Capacitor; PARTNO: C0603X5R1C104K030BC
C4 C8 C9 = jonnew:C: Capacitor; PARTNO: CL03A104KA3NNNC
C7 = jonnew:C: Capacitor; PARTNO: CL05A475MO5NUNC
C10 C11 C13-C16 C20-C23 C30 C31 C43-C48 C50-C52 C57-C61 C65-C67 C71 = jonnew:C: Capacitor
C12 C17 = jonnew:C: Capacitor; PARTNO: GRM155R61A475MEAAD
C19 C28 C34 C36 C49 = jonnew:C: Capacitor; PARTNO: CL03A105MP3ZSNH
C24 = jonnew:C: Capacitor; PARTNO: CL05A226MQ5QUNC
C25 = jonnew:C: Capacitor; PARTNO: C1005X7R1H104K050BB
C26 = jonnew:C: Capacitor; PARTNO: C1005X7R1H473K050BB
C29 = jonnew:C: Capacitor; PARTNO: GRM033R71E103KE14D
C37 C39 C41 C55 C63 C69 C70 C72 = jonnew:C: Capacitor; PARTNO: CL05A105KO5NNNC
C38 C40 C54 C56 = jonnew:C: Capacitor; PARTNO: CL05A106MQ5NUNC
C42 C64 = jonnew:C: Capacitor; PARTNO: UMK105BJ224KV-F
C53 C62 C68 = jonnew:C: Capacitor; PARTNO: GRM033R60J474KE90D
C73 = jonnew:C: Capacitor; PARTNO: CL05A226MQ6ZUN8
D4-D6 D8 = jonnew:PHOTODIODE
D7 = jonnew:LED: Surface mount LED
D9 = jonnew:S-DIODE: Schottky Diode
J5 = jonnew:PINHD-1X4
J8 = jonnew:PINHD-2X35+4
J9 = jonnew:PINHD-1X5_HALF_CONNETOR
L2 L4 L9 L11 L12 = jonnew:L: Inductor
L6-L8 L10 = jonnew:L: Inductor; PARTNO: BLM15PX601SN1D
R1 R2 R4-R8 R10-R19 R21-R57 = jonnew:R: Resistor
TP1-TP15 = jonnew:TP: Test pad
U1 = jonnew:QUAD-OPAMP_14PIN: OP AMP
U2 = jonnew:AD5683-VLOGIC
U3 = jonnew:CAT4016; PARTNO: CAT4016HV6-GT2
U4 = jonnew:TPL0501; PARTNO: TPL0501-100RSER
U5 = jonnew:MUX_2X4:1
U6 U8 U11 U12 = jonnew:TS4231
U7 = jonnew:RHD2164_BGA: Intan Technologies RHD2164 chip
U9 = jonnew:DS90UB913A
U10 = jonnew:BNO055
U13 U15 U17 U20 = jonnew:TLV707
U14 = jonnew:10M08DC
U16 = jonnew:LT3463
U18 = jonnew:TPS6262X
U19 = jonnew:CRYSTAL-OSC

## Net classes
1 thick: width 0.1 mm
2 diff: width 0.076 mm, drill 0.1 mm, clearance 0.051 mm